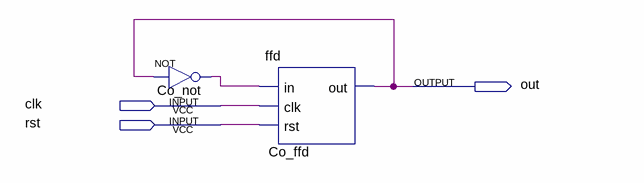
[diagram p0: schematic sheet]
// Quartus schematic fdiv.bdf as structural Verilog: 2 symbols, 3 pins
module fdiv (
  input  clk,
  input  rst,
  output out
);

  wire Co_not_out;

  not Co_not (Co_not_out, out);
  ffd Co_ffd (.in(Co_not_out), .clk(clk), .rst(rst), .out(out));
endmodule
